# Altium project PCB_LLC_v_12_12_22.PrjPcb
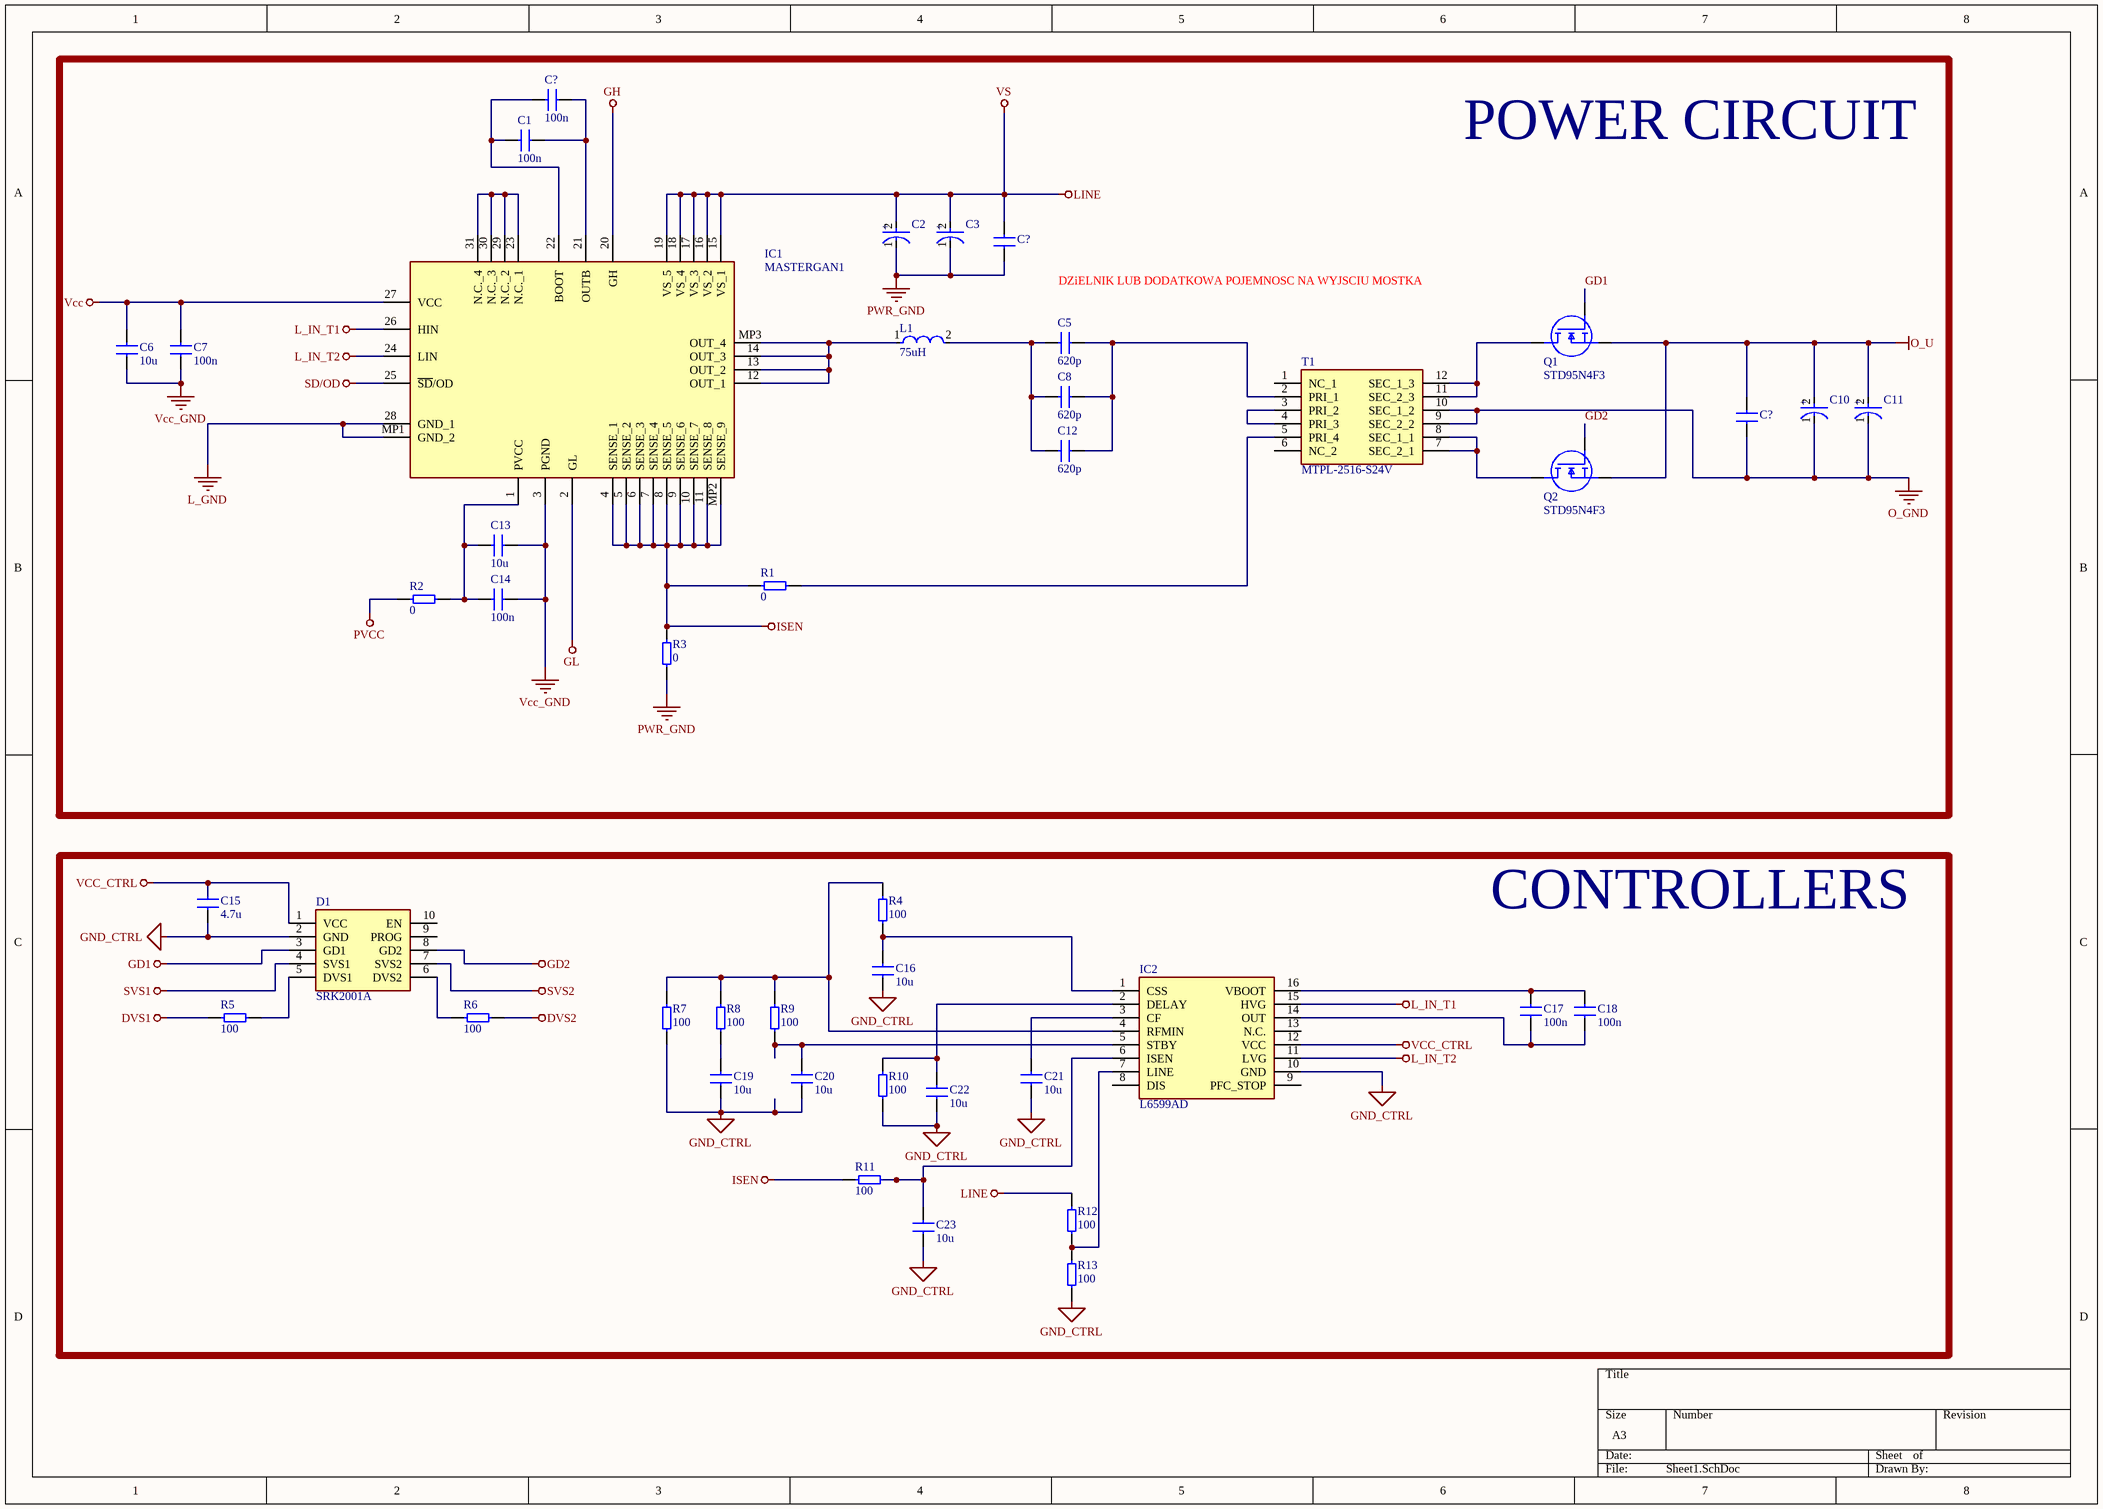
[diagram p0: Sheet1.SchDoc]
2 sheets, 74 parts. Net scope: global (net labels, ports and power ports of the same name join across sheets).
Sheets:
  Sheet1.SchDoc
  Sheet2.SchDoc

## Sheet Sheet1.SchDoc
size A3; SheetNumber: 1; SheetTotal: 2

### Parts
(Parts that share a designator on the sheet are numbered #1, #2 ... from top to bottom, then left to right.)
C1  100n  [Capcitor_1206]
C2  450BXW100MEFR18X30  [FP-BXW18X30-MFG]  (value not drawn)
C3  450BXW100MEFR18X30  [FP-BXW18X30-MFG]  (value not drawn)
C5  620p  [Capcitor_1206]
C6  10u  [Capcitor_1206]
C7  100n  [Capcitor_1206]
C8  620p  [Capcitor_1206]
C10  450BXW100MEFR18X30  [FP-BXW18X30-MFG]  (value not drawn)
C11  450BXW100MEFR18X30  [FP-BXW18X30-MFG]  (value not drawn)
C12  620p  [Capcitor_1206]
C13  10u  [Capcitor_1206]
C14  100n  [Capcitor_1206]
C15  4.7u  [Capcitor_1206]
C16  10u  [Capcitor_1206]
C17  100n  [Capcitor_1206]
C18  100n  [Capcitor_1206]
C19  10u  [Capcitor_1206]
C20  10u  [Capcitor_1206]
C21  10u  [Capcitor_1206]
C22  10u  [Capcitor_1206]
C23  10u  [Capcitor_1206]
C?#1  620p  [Capcitor_1206]  (value not drawn)
C?#2  620p  [Capcitor_1206]  (value not drawn)
C?#3  100n  [Capcitor_1206]
D1  SRK2001A  [SOIC127P600X175-8N]
IC1  MASTERGAN1  [MASTERGAN1]
IC2  L6599AD  [SOIC127P600X175-16N]
L1  75uH  [FP-IHLP-4040ED-FP_3_175x4-MFG]
Q1  STD95N4F3  [STD95N4F3]
Q2  STD95N4F3  [STD95N4F3]
R1  0  [Resistor_1206]
R2  0  [Resistor_1206]
R3  0  [Resistor_1206]
R4  100  [Resistor_1206]
R5  100  [Resistor_1206]
R6  100  [Resistor_1206]
R7  100  [Resistor_1206]
R8  100  [Resistor_1206]
R9  100  [Resistor_1206]
R10  100  [Resistor_1206]
R11  100  [Resistor_1206]
R12  100  [Resistor_1206]
R13  100  [Resistor_1206]
T1  MTPL-2516-S24V  [MTPL2516S24V]

### Blocks framed on the sheet
POWER CIRCUIT: C1-C3 C5-C8 C10-C14 C?#1-C?#3 IC1 L1 Q1 Q2 R1-R3 T1
CONTROLLERS: C15-C23 D1 IC2 R4-R13

### Nets
DVS1: R5.1
DVS2: R6.2
GD1: D1.3(GD1) Q1.1(G)
GD2: D1.8(GD2) Q2.1(G)
GH: IC1.20(GH)
GL: IC1.2(GL)
GND_CTRL: C15.2 C16.1 C19.1 C20.1 C21.1 C22.1 C23.1 D1.2(GND) IC2.10(GND) R7.1 R10.1 R13.1
ISEN: IC1.4(SENSE_1) IC1.5(SENSE_2) IC1.6(SENSE_3) IC1.7(SENSE_4) IC1.8(SENSE_5) IC1.9(SENSE_6) IC1.10(SENSE_7) IC1.11(SENSE_8) IC1.MP2(SENSE_9) R1.1 R3.2 R11.1
L_GND: IC1.28(GND_1) IC1.MP1(GND_2)
L_IN_T1: IC1.26(HIN) IC2.15(HVG)
L_IN_T2: IC1.24(LIN) IC2.11(LVG)
LINE: C2.2(A) C3.2(A) C?#1.2 IC1.15(VS_1) IC1.16(VS_2) IC1.17(VS_3) IC1.18(VS_4) IC1.19(VS_5) R12.2  [also labelled VS]
O_GND: C10.1(C) C11.1(C) C?#2.1 T1.9(SEC_2_2) T1.10(SEC_1_2)
O_U: C10.2(A) C11.2(A) C?#2.2 Q1.3(S) Q2.3(S)
PVCC: R2.1
PWR_GND: C2.1(C) C3.1(C) C?#1.1 R3.1
SD/OD: IC1.25(~{SD}/OD)
SVS1: D1.4(SVS1)
SVS2: D1.7(SVS2)
Vcc: C6.1 C7.1 IC1.27(VCC)
VCC_CTRL: C15.1 D1.1(VCC) IC2.12(VCC)
Vcc_GND: C6.2 C7.2 C13.2 C14.2 IC1.3(PGND)
NetC1_1: C1.1 C?#3.1 IC1.22(BOOT)
NetC1_2: C1.2 C?#3.2 IC1.21(OUTB)
NetC5_1: C5.1 C8.1 C12.1 L1.2
NetC5_2: C5.2 C8.2 C12.2 T1.2(PRI_1)
NetC13_1: C13.1 C14.1 IC1.1(PVCC) R2.2
NetC16_2: C16.2 IC2.1(CSS) R4.1
NetC17_1: C17.1 C18.1 IC2.14(OUT)
NetC17_2: C17.2 C18.2 IC2.16(VBOOT)
NetC19_2: C19.2 R8.1
NetC20_2: C20.2 IC2.5(STBY) R9.1
NetC21_2: C21.2 IC2.3(CF)
NetC22_2: C22.2 IC2.2(DELAY) R10.2
NetC23_2: C23.2 IC2.6(ISEN) R11.2
NetD1_5: D1.5(DVS1) R5.2
NetD1_6: D1.6(DVS2) R6.1
NetIC1_12: IC1.12(OUT_1) IC1.13(OUT_2) IC1.14(OUT_3) IC1.MP3(OUT_4) L1.1
NetIC1_23: IC1.23(N.C._1) IC1.29(N.C._2) IC1.30(N.C._3) IC1.31(N.C._4)
NetIC2_4: IC2.4(RFMIN) R4.2 R7.2 R8.2 R9.2
NetIC2_7: IC2.7(LINE) R12.1 R13.2
NetQ1_4: Q1.4(D) T1.11(SEC_2_3) T1.12(SEC_1_3)
NetQ2_4: Q2.4(D) T1.7(SEC_2_1) T1.8(SEC_1_1)
NetR1_2: R1.2 T1.5(PRI_4)
NetT1_3: T1.3(PRI_2) T1.4(PRI_3)

Not connected (* = marked no-connect by the designer): D1 9(PROG) 10(EN); IC2 8(DIS) 9(PFC_STOP) 13(N.C.); T1 1(NC_1) 6(NC_2)

### Notes on the sheet
- DZiELNIK LUB DODATKOWA POJEMNOSC NA WYJSCIU MOSTKA
- (in symbol CMP-35376-000021-1) +

### Library data of the parts
C1 C5-C8 C12-C23 C?#1-C?#3 = Capacitor_1206: Capacitor - Standard SMD; Voltage: 35 V; MPN: *
  C1 C7 C14 C17 C18 C?#3: Capacitance: 100n
  C5 C8 C12 C?#1 C?#2: Capacitance: 620p
  C6 C13 C16 C19-C23: Capacitance: 10u
  C15: Capacitance: 4.7u
C2 C3 C10 C11 = CMP-35376-000021-1: CAP ALUM 100UF 20% 450V RADIAL; Polarity: Polar; Life (Hours): 12000Hour; Ripple Current: 750mA; Case/Package: Radial; Capacitance: 100uF; Lead Pitch: 0.295inch; Packaging: Bulk; Mount: Through Hole; Tolerance: 20%; Height - Seated (Max): 1.26inch; Max Operating Temperature: 105°C; Min Operating Temperature: -40°C; Voltage Rating: 450V
D1 = SRK2001A: Diode; Manufacturer_Name: STMicroelectronics; Datasheet Link: https://componentsearchengine.com/Datasheets/1/SRK2001A.pdf; Height: 1.75mm; Manufacturer_Part_Number: SRK2001A; Mouser Part Number: 511-SRK2001A; Mouser Price/Stock: https://www.mouser.co.uk/ProductDetail/STMicroelectronics/SRK2001A?qs=aVyJF2WnouTzNJDK1aOmdg%3D%3D; Arrow Part Number: SRK2001A; Arrow Price/Stock: https://www.arrow.com/en/products/srk2001a/stmicroelectronics
IC1 = MASTERGAN1: Integrated Circuit; Manufacturer_Name: STMicroelectronics; Datasheet Link: https://www.mouser.com/datasheet/2/389/mastergan1-1893186.pdf; Height: 1mm; Manufacturer_Part_Number: MASTERGAN1; Mouser Part Number: 511-MASTERGAN1; Mouser Price/Stock: https://www.mouser.co.uk/ProductDetail/STMicroelectronics/MASTERGAN1?qs=hWgE7mdIu5TUQlvSzk235A%3D%3D; Arrow Part Number: MASTERGAN1; Arrow Price/Stock: https://www.arrow.com/en/products/mastergan1/stmicroelectronics?region=nac
IC2 = L6599AD: Integrated Circuit; Manufacturer_Name: STMicroelectronics; Datasheet Link: https://www.st.com/resource/en/datasheet/l6599a.pdf; Height: 1.75mm; Manufacturer_Part_Number: L6599AD; Mouser Part Number: 511-L6599AD; Mouser Price/Stock: https://www.mouser.co.uk/ProductDetail/STMicroelectronics/L6599AD?qs=7o0qgsFWxcZfFVshD8Fr5g%3D%3D; Arrow Part Number: L6599AD; Arrow Price/Stock: https://www.arrow.com/en/products/l6599ad/stmicroelectronics?region=nac
L1 = CMP-02424-000499-1: Automotive Inductors, High Temperature (155 °C) Series 47uH 3.6A 127.87mΩ 20%
Q1 Q2 = STD95N4F3: MOSFET (N-Channel); Manufacturer_Name: STMicroelectronics; Datasheet Link: https://www.st.com/resource/en/datasheet/std95n4f3.pdf; Height: 2.4mm; Manufacturer_Part_Number: STD95N4F3; Mouser Part Number: 511-STD95N4F3; Mouser Price/Stock: https://www.mouser.co.uk/ProductDetail/STMicroelectronics/STD95N4F3?qs=Djavi1aLnwoepdJqDxyf1g%3D%3D; Arrow Part Number: STD95N4F3; Arrow Price/Stock: https://www.arrow.com/en/products/std95n4f3/stmicroelectronics
R1-R13 = Resistor_1206: Resistor - Standard SMD; Power rate: *; MPN: *
  R1-R3: Resistance: 0
  R4-R13: Resistance: 100
T1 = MTPL-2516-S24V: Transformer; Manufacturer_Name: Vishay; Datasheet Link: https://componentsearchengine.com/Datasheets/2/MTPL-2516-S24V.pdf; Height: 16.51mm; Manufacturer_Part_Number: MTPL-2516-S24V; Mouser Part Number: 70-MTPL-2516-S24V; Mouser Price/Stock: https://www.mouser.co.uk/ProductDetail/Vishay-Dale/MTPL-2516-S24V?qs=wd5RIQLrsJgVmtJW6evrjA%3D%3D

## Sheet Sheet2.SchDoc
size A3; SheetNumber: 2; SheetTotal: 2
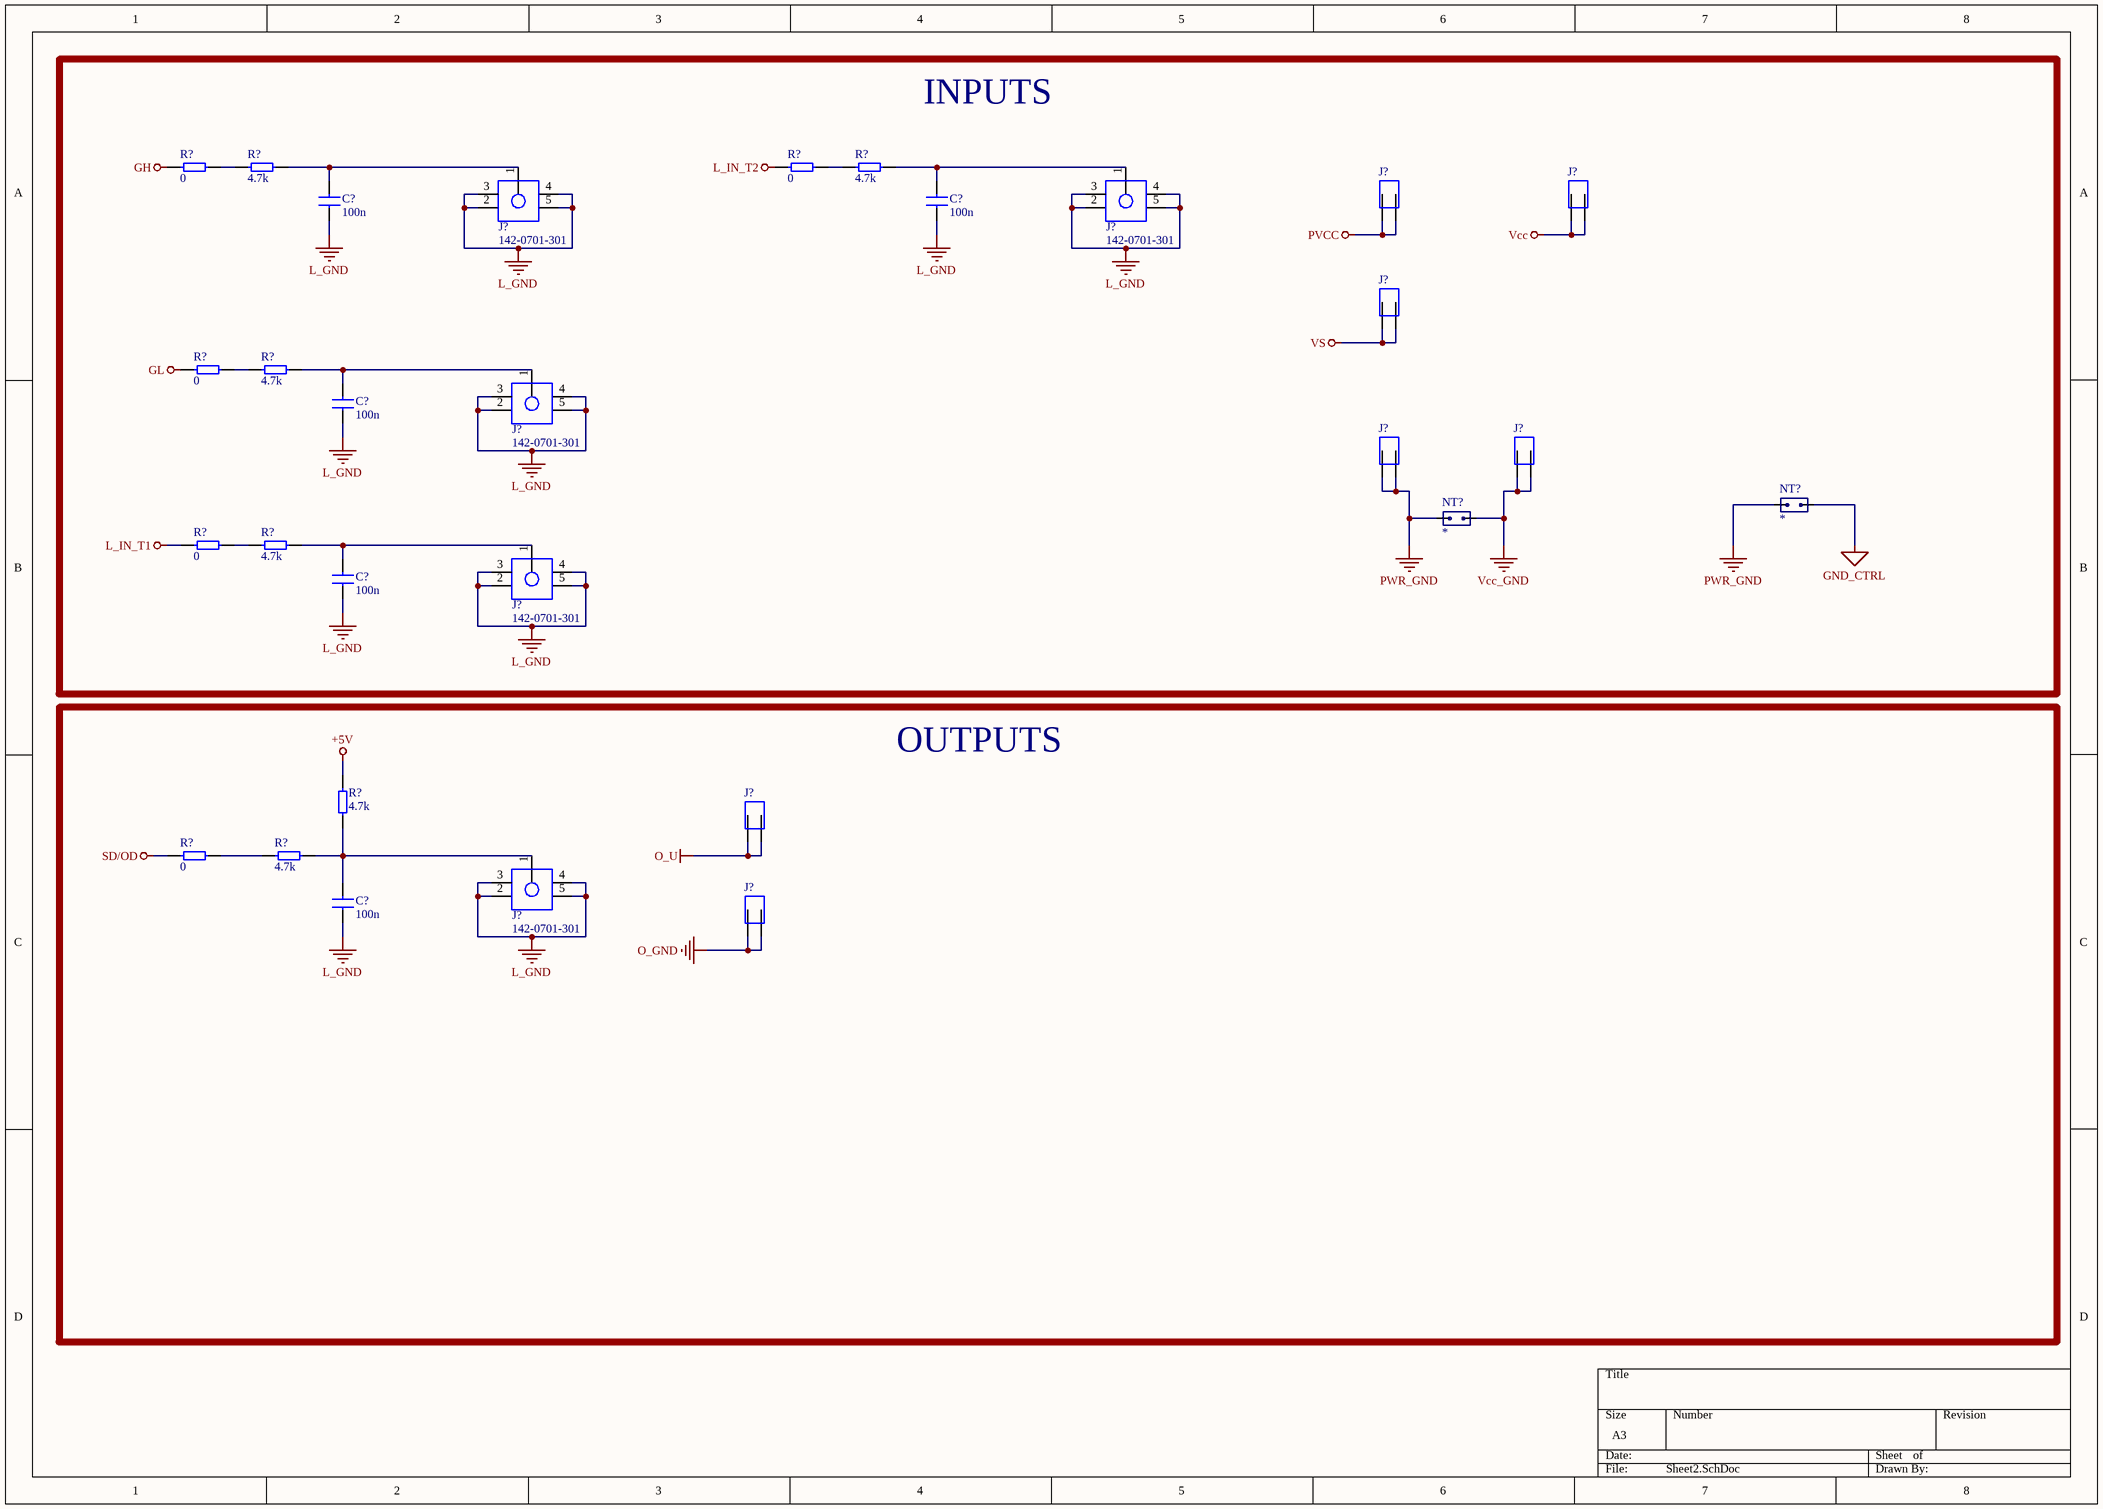
[diagram p1: Sheet2.SchDoc]

### Parts
(Parts that share a designator on the sheet are numbered #1, #2 ... from top to bottom, then left to right.)
C?#4  100n  [Capcitor_1206]
C?#5  100n  [Capcitor_1206]
C?#6  100n  [Capcitor_1206]
C?#7  100n  [Capcitor_1206]
C?#8  100n  [Capcitor_1206]
J?#1  142-0701-301  [1420701301]
J?#2  142-0701-301  [1420701301]
J?#3  1289-STR  [1289STR]  (value not drawn)
J?#4  1289-STR  [1289STR]  (value not drawn)
J?#5  1289-STR  [1289STR]  (value not drawn)
J?#6  142-0701-301  [1420701301]
J?#7  1289-STR  [1289STR]  (value not drawn)
J?#8  1289-STR  [1289STR]  (value not drawn)
J?#9  142-0701-301  [1420701301]
J?#10  1289-STR  [1289STR]  (value not drawn)
J?#11  142-0701-301  [1420701301]
J?#12  1289-STR  [1289STR]  (value not drawn)
NT?#1  *  [Net tie]  (net tie, no BOM)
NT?#2  *  [Net tie]  (net tie, no BOM)
R?#1  0  [Resistor_1206]
R?#2  4.7k  [Resistor_1206]
R?#3  0  [Resistor_1206]
R?#4  4.7k  [Resistor_1206]
R?#5  0  [Resistor_1206]
R?#6  4.7k  [Resistor_1206]
R?#7  0  [Resistor_1206]
R?#8  4.7k  [Resistor_1206]
R?#9  4.7k  [Resistor_1206]
R?#10  0  [Resistor_1206]
R?#11  4.7k  [Resistor_1206]

### Blocks framed on the sheet
INPUTS: C?#4-C?#7 J?#1-J?#9 NT?#1 NT?#2 R?#1-R?#8
OUTPUTS: C?#8 J?#10-J?#12 R?#9-R?#11

### Nets
+5V: R?#9.2
GH: R?#1.2
GL: R?#5.2
GND_CTRL: NT?#1.2
L_GND: C?#4.2 C?#5.2 C?#6.2 C?#7.2 C?#8.2 J?#1.2 J?#1.3 J?#1.4 J?#1.5 J?#2.2 J?#2.3 J?#2.4 J?#2.5 J?#6.2 J?#6.3 J?#6.4 J?#6.5 J?#9.2 J?#9.3 J?#9.4 J?#9.5 J?#11.2 J?#11.3 J?#11.4 J?#11.5
L_IN_T1: R?#7.2
L_IN_T2: R?#3.2
O_GND: J?#12.1 J?#12.2
O_U: J?#10.1 J?#10.2
PVCC: J?#3.1 J?#3.2
PWR_GND: J?#7.1 J?#7.2 NT?#1.1 NT?#2.1
SD/OD: R?#10.2
Vcc: J?#4.1 J?#4.2
Vcc_GND: J?#8.1 J?#8.2 NT?#2.2
VS: J?#5.1 J?#5.2  [project net LINE]
NetC?#4_1: C?#4.1 J?#1.1 R?#2.1
NetC?#5_1: C?#5.1 J?#2.1 R?#4.1
NetC?#6_1: C?#6.1 J?#6.1 R?#6.1
NetC?#7_1: C?#7.1 J?#9.1 R?#8.1
NetC?#8_1: C?#8.1 J?#11.1 R?#9.1 R?#11.1
NetR?#1_1: R?#1.1 R?#2.2
NetR?#3_1: R?#3.1 R?#4.2
NetR?#5_1: R?#5.1 R?#6.2
NetR?#7_1: R?#7.1 R?#8.2
NetR?#10_1: R?#10.1 R?#11.2

### Library data of the parts
C?#4-C?#8 = Capacitor_1206: Capacitor - Standard SMD; Voltage: 35 V; Capacitance: 100n; MPN: *
J?#1 J?#2 J?#6 J?#9 J?#11 = 142-0701-301: Connector; Manufacturer_Name: Cinch Connectivity Solutions; Datasheet Link: https://datasheet.datasheetarchive.com/originals/distributors/Datasheets_SAMA/2ec9b041f970d014d2778887508fd87c.pdf; Height: 9.779mm; Manufacturer_Part_Number: 142-0701-301; Mouser Part Number: 530-142-0701-301; Mouser Price/Stock: https://www.mouser.co.uk/ProductDetail/Johnson-Cinch-Connectivity-Solutions/142-0701-301?qs=VqHsQWpF6un5h9kBF%252BTxDw%3D%3D; Arrow Part Number: 142-0701-301; Arrow Price/Stock: https://www.arrow.com/en/products/142-0701-301/cinch-connectivity-solutions?region=nac
J?#3-J?#5 J?#7 J?#8 J?#10 J?#12 = 1289-STR: Connector; Manufacturer_Name: Keystone Electronics; Datasheet Link: https://www.mouser.com/datasheet/2/215/Keystone_Electronics_12182018_1289-ST-1510776.pdf; Height: 14.37mm; Manufacturer_Part_Number: 1289-STR; Mouser Part Number: 534-1289-STR; Mouser Price/Stock: https://www.mouser.co.uk/ProductDetail/Keystone-Electronics/1289-STR?qs=0lSvoLzn4L%252BMUIbPVNHg8g%3D%3D
NT?#1 NT?#2 = Net tie: Value: *; HelpURL: *; MPN: *
R?#1-R?#11 = Resistor_1206: Resistor - Standard SMD; Power rate: *; MPN: *
  R?#1 R?#3 R?#5 R?#7 R?#10: Resistance: 0
  R?#2 R?#4 R?#6 R?#8 R?#9 R?#11: Resistance: 4.7k

## Nets that join several sheets
GH: Sheet1 (IC1.20), Sheet2 (R?#1.2)
GL: Sheet1 (IC1.2), Sheet2 (R?#5.2)
GND_CTRL: Sheet1 (12 pins), Sheet2 (NT?#1.2)
L_GND: Sheet1 (IC1.28 IC1.MP1), Sheet2 (25 pins)
L_IN_T1: Sheet1 (IC1.26 IC2.15), Sheet2 (R?#7.2)
L_IN_T2: Sheet1 (IC1.24 IC2.11), Sheet2 (R?#3.2)
LINE: Sheet1 (9 pins), Sheet2 (J?#5.1 J?#5.2)
O_GND: Sheet1 (5 pins), Sheet2 (J?#12.1 J?#12.2)
O_U: Sheet1 (5 pins), Sheet2 (J?#10.1 J?#10.2)
PVCC: Sheet1 (R2.1), Sheet2 (J?#3.1 J?#3.2)
PWR_GND: Sheet1 (C2.1 C3.1 C?#1.1 R3.1), Sheet2 (J?#7.1 J?#7.2 NT?#1.1 NT?#2.1)
SD/OD: Sheet1 (IC1.25), Sheet2 (R?#10.2)
Vcc: Sheet1 (C6.1 C7.1 IC1.27), Sheet2 (J?#4.1 J?#4.2)
Vcc_GND: Sheet1 (5 pins), Sheet2 (J?#8.1 J?#8.2 NT?#2.2)